# Altium schematic sheet Comparator.SchDoc
size A4; SheetNumber: 5; SheetTotal: 7
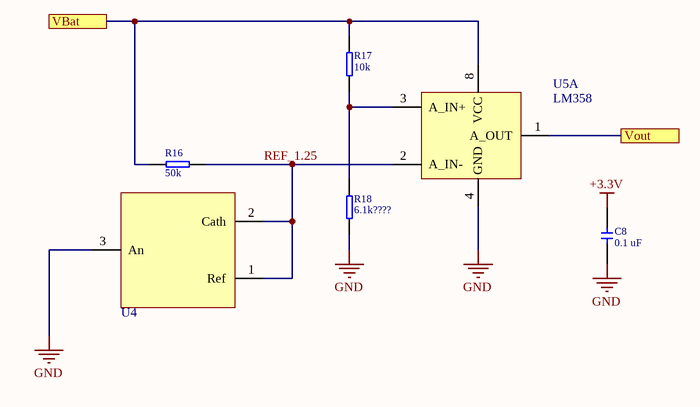
[diagram p0: Comparator.SchDoc]

## Parts
C8  value 0.1 uF  [CERCAP 0402]
R16  value 50k  [RES 0402]
R17  value 10k  [RES 0402]
R18  value 6.1k????  [RES 0402]
U4  Voltage_Ref  [SOT23-3]  (value not drawn)
U5  LM358  [SO-8]  (part A of 2)

## Ports
VBat, Vout

## Nets
+3.3V: C8.2
GND: C8.1 R18.1 U4.3(An) U5.4(GND)
REF_1.25: R16.2 U4.1(Ref) U4.2(Cath) U5.2(A_IN-)
VBat: R16.1 R17.1 U5.8(VCC) ; port VBat
Vout: U5.1(A_OUT) ; port Vout
NetR17_2: R17.2 R18.2 U5.3(A_IN+)

## Library data of the parts
C8 = !Capacitor: Capacitor; IsSMT: NoSMT; Diel: X7R; Voltage: *
R16-R18 = !Resistor: Resistor; IsSMT: NoSMT
U5 = DualOpAmp: Operational amplifier